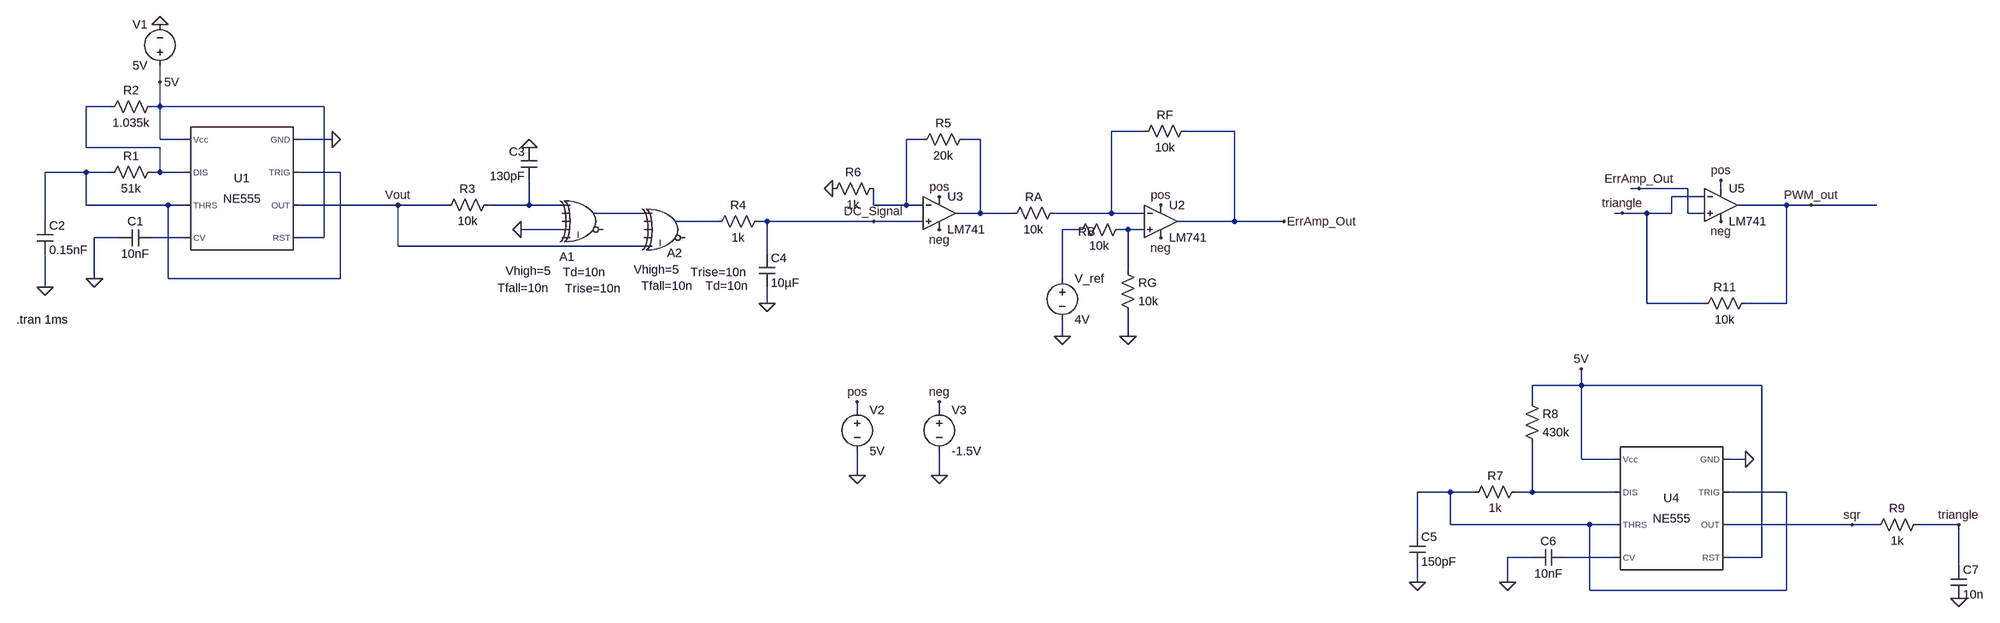
[diagram p0: schematic water_level.asc]
water_level.asc, the LTspice schematic file:
Version 4
SHEET 1 3904 1672
WIRE -400 256 -400 224
WIRE -496 304 -544 304
WIRE -400 304 -400 256
WIRE -400 304 -416 304
WIRE -80 304 -400 304
WIRE 1520 352 1456 352
WIRE 1696 352 1600 352
WIRE -400 368 -400 304
WIRE -352 368 -400 368
WIRE -64 368 -128 368
WIRE 1088 368 1056 368
WIRE 1200 368 1168 368
WIRE -544 384 -544 304
WIRE -400 384 -544 384
WIRE -544 432 -624 432
WIRE -496 432 -544 432
WIRE -400 432 -400 384
WIRE -400 432 -416 432
WIRE -352 432 -400 432
WIRE -48 432 -128 432
WIRE 2496 464 2480 464
WIRE 2592 464 2496 464
WIRE 2656 464 2656 448
WIRE 2624 480 2560 480
WIRE -544 496 -544 432
WIRE -384 496 -544 496
WIRE -352 496 -384 496
WIRE 64 496 -128 496
WIRE 160 496 64 496
WIRE 320 496 320 448
WIRE 320 496 240 496
WIRE 384 496 320 496
WIRE 992 496 992 464
WIRE 1056 496 1056 368
WIRE 1056 496 992 496
WIRE 1088 496 1056 496
WIRE 2784 496 2688 496
WIRE 2832 496 2784 496
WIRE 2960 496 2832 496
WIRE 544 512 448 512
WIRE 1200 512 1200 368
WIRE 1200 512 1152 512
WIRE 1264 512 1200 512
WIRE 1456 512 1456 352
WIRE 1456 512 1344 512
WIRE 1520 512 1456 512
WIRE 2464 512 2448 512
WIRE 2512 512 2464 512
WIRE 2560 512 2560 480
WIRE 2560 512 2512 512
WIRE 2592 512 2592 464
WIRE 2624 512 2592 512
WIRE -624 528 -624 432
WIRE 688 528 608 528
WIRE 784 528 768 528
WIRE 992 528 784 528
WIRE 1088 528 992 528
WIRE 1696 528 1696 352
WIRE 1696 528 1584 528
WIRE 1792 528 1696 528
WIRE 2656 528 2656 512
WIRE 384 544 304 544
WIRE 1392 544 1360 544
WIRE 1488 544 1472 544
WIRE 1520 544 1488 544
WIRE -480 560 -528 560
WIRE -352 560 -416 560
WIRE -80 560 -80 304
WIRE -80 560 -128 560
WIRE 64 576 64 496
WIRE 544 576 64 576
WIRE 784 592 784 528
WIRE 1488 624 1488 544
WIRE -528 640 -528 560
WIRE -384 640 -384 496
WIRE -48 640 -48 432
WIRE -48 640 -384 640
WIRE 1360 640 1360 544
WIRE -624 656 -624 592
WIRE 784 688 784 656
WIRE 2512 688 2512 512
WIRE 2624 688 2512 688
WIRE 2784 688 2784 496
WIRE 2784 688 2704 688
WIRE 1360 752 1360 720
WIRE 1488 752 1488 704
WIRE 2384 848 2384 816
WIRE 2384 848 2288 848
WIRE 2736 848 2384 848
WIRE 2288 880 2288 848
WIRE 960 896 960 880
WIRE 1120 896 1120 880
WIRE 2384 992 2384 848
WIRE 2448 992 2384 992
WIRE 2704 992 2672 992
WIRE 960 1024 960 976
WIRE 1120 1024 1120 976
WIRE 2128 1056 2064 1056
WIRE 2176 1056 2128 1056
WIRE 2288 1056 2288 960
WIRE 2288 1056 2256 1056
WIRE 2448 1056 2288 1056
WIRE 2784 1056 2672 1056
WIRE 2128 1120 2128 1056
WIRE 2400 1120 2128 1120
WIRE 2448 1120 2400 1120
WIRE 2912 1120 2672 1120
WIRE 2960 1120 2912 1120
WIRE 3120 1120 3040 1120
WIRE 2064 1136 2064 1056
WIRE 2288 1184 2240 1184
WIRE 2448 1184 2352 1184
WIRE 2736 1184 2736 848
WIRE 2736 1184 2672 1184
WIRE 3120 1200 3120 1120
WIRE 2064 1232 2064 1200
WIRE 2240 1232 2240 1184
WIRE 2400 1248 2400 1120
WIRE 2784 1248 2784 1056
WIRE 2784 1248 2400 1248
FLAG -624 656 0
FLAG -528 640 0
FLAG -64 368 0
FLAG 64 496 Vout
FLAG -400 144 0
FLAG 320 384 0
FLAG 784 688 0
FLAG 304 544 0
FLAG 960 1024 0
FLAG 960 880 pos
FLAG 1552 496 pos
FLAG 1488 752 0
FLAG 1360 752 0
FLAG 1120 480 pos
FLAG 1120 544 neg
FLAG 1552 560 neg
FLAG 1120 1024 0
FLAG 1120 880 neg
FLAG 992 528 DC_Signal
FLAG 1792 528 ErrAmp_Out
FLAG -400 256 5V
FLAG 2384 816 5V
FLAG 2064 1232 0
FLAG 2240 1232 0
FLAG 2704 992 0
FLAG 2832 496 PWM_out
FLAG 2464 512 triangle
FLAG 2656 448 pos
FLAG 2912 1120 sqr
FLAG 2656 528 neg
FLAG 3120 1264 0
FLAG 3120 1120 triangle
FLAG 2496 464 ErrAmp_Out
FLAG 912 464 0
SYMBOL Misc\\NE555 -240 464 M0
SYMATTR InstName U1
SYMBOL cap -416 544 R90
WINDOW 0 0 32 VBottom 2
WINDOW 3 32 32 VTop 2
SYMATTR InstName C1
SYMATTR Value 10nF
SYMBOL res -400 416 R90
WINDOW 0 0 56 VBottom 2
WINDOW 3 32 56 VTop 2
SYMATTR InstName R1
SYMATTR Value 51k
SYMBOL cap -640 528 R0
SYMATTR InstName C2
SYMATTR Value 0.15nF
SYMBOL res -400 288 R90
WINDOW 0 0 56 VBottom 2
WINDOW 3 32 56 VTop 2
SYMATTR InstName R2
SYMATTR Value 1.035k
SYMBOL voltage -400 240 R180
WINDOW 0 24 96 Left 2
WINDOW 3 24 16 Left 2
WINDOW 123 0 0 Left 0
WINDOW 39 0 0 Left 0
SYMATTR InstName V1
SYMATTR Value 5V
SYMBOL Digital\\xor 432 464 R0
WINDOW 0 -53 133 Left 2
WINDOW 3 -158 161 Left 2
WINDOW 123 -42 195 Left 2
WINDOW 39 -174 194 Left 2
WINDOW 40 -46 163 Left 2
SYMATTR InstName A1
SYMATTR Value Vhigh=5
SYMATTR Value2 Trise=10n
SYMATTR SpiceLine Tfall=10n
SYMATTR SpiceLine2 Td=10n
SYMBOL res 256 480 R90
WINDOW 0 0 56 VBottom 2
WINDOW 3 32 56 VTop 2
SYMATTR InstName R3
SYMATTR Value 10k
SYMBOL cap 336 448 R180
WINDOW 0 24 56 Left 2
WINDOW 3 24 8 Left 2
SYMATTR InstName C3
SYMATTR Value 130pF
SYMBOL Digital\\xor 592 480 R0
WINDOW 0 -3 110 Left 2
WINDOW 3 -68 142 Left 2
WINDOW 123 43 147 Left 2
WINDOW 39 -53 174 Left 2
WINDOW 40 72 174 Left 2
SYMATTR InstName A2
SYMATTR Value Vhigh=5
SYMATTR Value2 Trise=10n
SYMATTR SpiceLine Tfall=10n
SYMATTR SpiceLine2 Td=10n
SYMBOL res 784 512 R90
WINDOW 0 0 56 VBottom 2
WINDOW 3 32 56 VTop 2
SYMATTR InstName R4
SYMATTR Value 1k
SYMBOL cap 768 592 R0
SYMATTR InstName C4
SYMATTR Value 10µF
SYMBOL OpAmps\\LM741 1552 464 R0
SYMATTR InstName U2
SYMBOL res 1488 528 R90
WINDOW 0 36 81 VBottom 2
WINDOW 3 32 56 VTop 2
SYMATTR InstName RB
SYMATTR Value 10k
SYMBOL voltage 960 880 R0
SYMATTR InstName V2
SYMATTR Value 5V
SYMBOL res 1472 608 R0
SYMATTR InstName RG
SYMATTR Value 10k
SYMBOL res 1360 496 R90
WINDOW 0 0 56 VBottom 2
WINDOW 3 32 56 VTop 2
SYMATTR InstName RA
SYMATTR Value 10k
SYMBOL res 1616 336 R90
WINDOW 0 0 56 VBottom 2
WINDOW 3 32 56 VTop 2
SYMATTR InstName RF
SYMATTR Value 10k
SYMBOL voltage 1360 624 R0
WINDOW 123 0 0 Left 0
WINDOW 39 0 0 Left 0
SYMATTR InstName V_ref
SYMATTR Value 4V
SYMBOL OpAmps\\LM741 1120 448 R0
SYMATTR InstName U3
SYMBOL res 896 480 R270
WINDOW 0 32 56 VTop 2
WINDOW 3 0 56 VBottom 2
SYMATTR InstName R6
SYMATTR Value 1k
SYMBOL res 1184 352 R90
WINDOW 0 0 56 VBottom 2
WINDOW 3 32 56 VTop 2
SYMATTR InstName R5
SYMATTR Value 20k
SYMBOL voltage 1120 880 R0
WINDOW 123 0 0 Left 0
WINDOW 39 0 0 Left 0
SYMATTR InstName V3
SYMATTR Value -1.5V
SYMBOL Misc\\NE555 2560 1088 M0
SYMATTR InstName U4
SYMBOL res 2272 1040 R90
WINDOW 0 0 56 VBottom 2
WINDOW 3 32 56 VTop 2
SYMATTR InstName R7
SYMATTR Value 1k
SYMBOL res 2272 864 R0
SYMATTR InstName R8
SYMATTR Value 430k
SYMBOL cap 2048 1136 R0
SYMATTR InstName C5
SYMATTR Value 150pF
SYMBOL cap 2352 1168 R90
WINDOW 0 0 32 VBottom 2
WINDOW 3 32 32 VTop 2
SYMATTR InstName C6
SYMATTR Value 10nF
SYMBOL res 2720 672 R90
WINDOW 0 0 56 VBottom 2
WINDOW 3 32 56 VTop 2
SYMATTR InstName R11
SYMATTR Value 10k
SYMBOL res 3056 1104 R90
WINDOW 0 0 56 VBottom 2
WINDOW 3 32 56 VTop 2
SYMATTR InstName R9
SYMATTR Value 1k
SYMBOL cap 3104 1200 R0
SYMATTR InstName C7
SYMATTR Value 10n
SYMBOL OpAmps\\LM741 2656 432 R0
SYMATTR InstName U5
TEXT -680 720 Left 2 !.tran 1ms

The netlist it stands for:
* water_level.asc
XU1 0 N005 Vout 5V N011 N005 N001 5V NE555  ; pins GND TRIG OUT RST CV THRS DIS Vcc
C1 N011 0 10nF
R1 N001 N005 51k
C2 N005 0 0.15nF
R2 5V N001 1.035k
V1 5V 0 5V
A1 N006 0 0 0 0 0 N007 0 XOR Vhigh=5 Trise=10n Tfall=10n Td=10n
R3 N006 Vout 10k
C3 N006 0 130pF
A2 N007 0 0 0 Vout 0 N008 0 XOR Vhigh=5 Trise=10n Tfall=10n Td=10n
R4 DC_Signal N008 1k
C4 DC_Signal 0 10µF
XU2 N010 N002 pos neg ErrAmp_Out LM741  ; pins In+ In- V+ V- OUT
RB N010 N009 10k
V2 pos 0 5V
RG N010 0 10k
RA N002 N004 10k
RF ErrAmp_Out N002 10k
V_ref N009 0 4V
XU3 DC_Signal N003 pos neg N004 LM741  ; pins In+ In- V+ V- OUT
R6 0 N003 1k
R5 N004 N003 20k
V3 neg 0 -1.5V
XU4 0 N012 sqr 5V N014 N012 N013 5V NE555  ; pins GND TRIG OUT RST CV THRS DIS Vcc
R7 N013 N012 1k
R8 5V N013 430k
C5 N012 0 150pF
C6 N014 0 10nF
R11 PWM_out triangle 10k
R9 triangle sqr 1k
C7 triangle 0 10n
XU5 ErrAmp_Out triangle pos neg PWM_out LM741  ; pins In+ In- V+ V- OUT
.tran 1ms
.lib NE555.sub
.lib LM741.lib
.backanno
.end